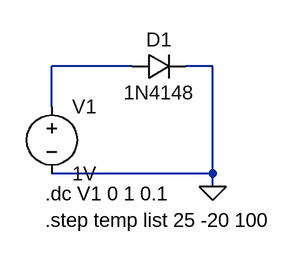
[diagram p0: schematic iv_char_diode.asc]
iv_char_diode.asc, the LTspice schematic file:
Version 4
SHEET 1 880 680
WIRE 144 96 48 96
WIRE 240 96 208 96
WIRE 48 144 48 96
WIRE 240 224 240 96
WIRE 240 224 48 224
WIRE 240 240 240 224
FLAG 240 240 0
SYMBOL diode 144 112 R270
WINDOW 0 32 32 VTop 2
WINDOW 3 0 32 VBottom 2
SYMATTR InstName D1
SYMATTR Value 1N4148
SYMBOL voltage 48 128 R0
WINDOW 123 0 0 Left 0
WINDOW 39 0 0 Left 0
SYMATTR InstName V1
SYMATTR Value 1V
TEXT 40 248 Left 2 !.dc V1 0 1 0.1
TEXT 40 280 Left 2 !.step temp list 25 -20 100

The netlist it stands for:
* iv_char_diode.asc
D1 N001 0 1N4148
V1 N001 0 1V
.model D D
.lib standard.dio
.dc V1 0 1 0.1
.step temp list 25 -20 100
.backanno
.end